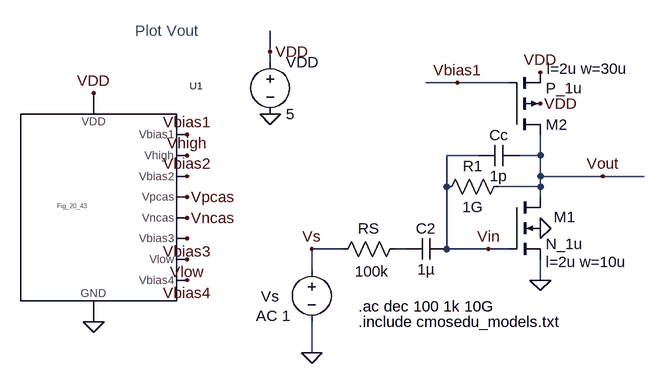
[diagram p0: schematic Fig21_29.asc]
Fig21_29.asc, the LTspice schematic file:
Version 4
SHEET 1 1784 680
WIRE 1072 -304 1072 -336
WIRE 1072 -288 1072 -304
WIRE 1360 -256 1312 -256
WIRE 1440 -256 1360 -256
WIRE 1392 -144 1344 -144
WIRE 1488 -144 1488 -176
WIRE 1488 -144 1456 -144
WIRE 1488 -112 1488 -144
WIRE 1584 -112 1488 -112
WIRE 1648 -112 1584 -112
WIRE 1344 -96 1344 -144
WIRE 1488 -96 1488 -112
WIRE 1488 -96 1424 -96
WIRE 1488 -80 1488 -96
WIRE 1184 0 1136 0
WIRE 1280 0 1264 0
WIRE 1344 0 1344 -96
WIRE 1408 0 1344 0
WIRE 1440 0 1408 0
WIRE 1136 32 1136 0
WIRE 1488 48 1488 16
WIRE 1136 160 1136 112
FLAG 1072 -208 0
FLAG 1072 -304 VDD
FLAG 1488 -32 0
FLAG 1488 48 0
FLAG 1488 -272 VDD
FLAG 1488 -224 VDD
FLAG 800 -240 VDD
FLAG 800 112 0
FLAG 944 -176 Vbias1
FLAG 944 -144 Vhigh
FLAG 944 -112 Vbias2
FLAG 944 -16 Vbias3
FLAG 944 -80 Vpcas
FLAG 944 -48 Vncas
FLAG 944 48 Vbias4
FLAG 944 16 Vlow
FLAG 1584 -112 Vout
FLAG 1136 160 0
FLAG 1408 0 Vin
FLAG 1360 -256 Vbias1
FLAG 1136 0 Vs
SYMBOL voltage 1072 -304 R0
WINDOW 123 0 0 Left 2
WINDOW 39 0 0 Left 2
SYMATTR InstName VDD
SYMATTR Value 5
SYMBOL nmos4 1440 -80 R0
WINDOW 123 56 100 Left 2
WINDOW 0 69 31 Left 2
SYMATTR Value2 l=2u w=10u
SYMATTR InstName M1
SYMATTR Value N_1u
SYMBOL pmos4 1440 -176 M180
WINDOW 123 58 102 Left 2
WINDOW 0 56 16 Left 2
SYMATTR Value2 l=2u w=30u
SYMATTR InstName M2
SYMATTR Value P_1u
SYMBOL Fig_20_43 800 -64 R0
SYMATTR InstName U1
SYMBOL voltage 1136 16 R0
WINDOW 123 -86 87 Left 2
WINDOW 39 0 0 Left 2
WINDOW 3 30 93 Left 2
WINDOW 0 -78 57 Left 2
SYMATTR Value2 AC 1
SYMATTR Value ""
SYMATTR InstName Vs
SYMBOL res 1328 -80 R270
WINDOW 0 32 56 VTop 2
WINDOW 3 0 56 VBottom 2
SYMATTR InstName R1
SYMATTR Value 1G
SYMBOL res 1168 16 R270
WINDOW 0 32 56 VTop 2
WINDOW 3 -3 61 VBottom 2
SYMATTR InstName RS
SYMATTR Value 100k
SYMBOL cap 1280 16 R270
WINDOW 0 32 32 VTop 2
WINDOW 3 0 32 VBottom 2
SYMATTR InstName C2
SYMATTR Value 1µ
SYMBOL cap 1392 -128 R270
WINDOW 0 32 32 VTop 2
WINDOW 3 0 32 VBottom 2
SYMATTR InstName Cc
SYMATTR Value 1p
TEXT 1208 112 Left 2 !.include cmosedu_models.txt
TEXT 864 -336 Left 2 ;Plot Vout
TEXT 1208 88 Left 2 !.ac dec 100 1k 10G

The netlist it stands for:
* Fig21_29.asc
VDD VDD 0 5
M1 Vout Vin 0 0 N_1u l=2u w=10u
M2 Vout Vbias1 VDD VDD P_1u l=2u w=30u
XU1 Vbias1 Vhigh Vbias2 Vpcas Vncas Vbias3 Vlow Vbias4 VDD 0 Fig_20_43  ; pins Vbias1 Vhigh Vbias2 Vpcas Vncas Vbias3 Vlow Vbias4 VDD GND
Vs Vs 0 AC 1
R1 Vin Vout 1G
RS Vs N001 100k
C2 N001 Vin 1µ
Cc Vin Vout 1p
.model NMOS NMOS
.model PMOS PMOS
.lib standard.mos
.include cmosedu_models.txt
* Plot Vout
.ac dec 100 1k 10G
.backanno
.end